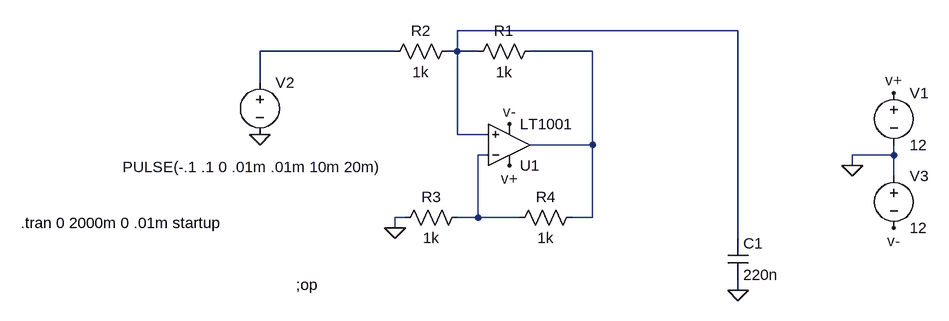
[diagram p0: schematic real pos neg offset.asc]
real pos neg offset.asc, the LTspice schematic file:
Version 4
SHEET 1 1060 680
WIRE 560 16 128 16
WIRE 32 48 -176 48
WIRE 128 48 128 16
WIRE 128 48 112 48
WIRE 160 48 128 48
WIRE 336 48 240 48
WIRE -176 96 -176 48
WIRE 128 176 128 48
WIRE 176 176 128 176
WIRE 336 192 336 48
WIRE 336 192 240 192
WIRE 176 208 160 208
WIRE 800 208 800 192
WIRE 800 208 736 208
WIRE 736 224 736 208
WIRE 800 240 800 208
WIRE 48 304 32 304
WIRE 160 304 160 208
WIRE 160 304 128 304
WIRE 224 304 160 304
WIRE 336 304 336 192
WIRE 336 304 304 304
WIRE 32 320 32 304
WIRE 560 336 560 16
WIRE 560 416 560 400
FLAG 32 320 0
FLAG 560 416 0
FLAG -176 176 0
FLAG 736 224 0
FLAG 800 112 v+
FLAG 208 224 v+
FLAG 800 320 v-
FLAG 208 160 v-
DATAFLAG 336 112 ""
SYMBOL res 256 32 R90
WINDOW 0 0 56 VBottom 2
WINDOW 3 32 56 VTop 2
SYMATTR InstName R1
SYMATTR Value 1k
SYMBOL res 128 32 R90
WINDOW 0 0 56 VBottom 2
WINDOW 3 32 56 VTop 2
SYMATTR InstName R2
SYMATTR Value 1k
SYMBOL res 144 288 R90
WINDOW 0 0 56 VBottom 2
WINDOW 3 32 56 VTop 2
SYMATTR InstName R3
SYMATTR Value 1k
SYMBOL res 320 288 R90
WINDOW 0 0 56 VBottom 2
WINDOW 3 32 56 VTop 2
SYMATTR InstName R4
SYMATTR Value 1k
SYMBOL cap 544 336 R0
SYMATTR InstName C1
SYMATTR Value 220n
SYMBOL voltage -176 80 R0
WINDOW 3 -211 146 Left 2
WINDOW 123 0 0 Left 0
WINDOW 39 0 0 Left 0
SYMATTR Value PULSE(-.1 .1 0 .01m .01m 10m 20m)
SYMATTR InstName V2
SYMBOL OpAmps\\LT1001 208 256 M180
SYMATTR InstName U1
SYMBOL voltage 800 96 R0
WINDOW 123 0 0 Left 0
WINDOW 39 0 0 Left 0
SYMATTR InstName V1
SYMATTR Value 12
SYMBOL voltage 800 224 R0
WINDOW 123 0 0 Left 0
WINDOW 39 0 0 Left 0
SYMATTR InstName V3
SYMATTR Value 12
TEXT -120 408 Left 2 !;op
TEXT -544 312 Left 2 !.tran 0 2000m 0 .01m startup

The netlist it stands for:
* real pos neg offset.asc
R1 N003 N001 1k
R2 N001 N002 1k
R3 N004 0 1k
R4 N003 N004 1k
C1 N001 0 220n
V2 N002 0 PULSE(-.1 .1 0 .01m .01m 10m 20m)
XU1 N001 N004 v+ v- N003 LT1001  ; pins In+ In- V+ V- OUT
V1 v+ 0 12
V3 0 v- 12
;op
.tran 0 2000m 0 .01m startup
.lib LTC.lib
.backanno
.end